# EAGLE design M850x (EAGLE 4.11)
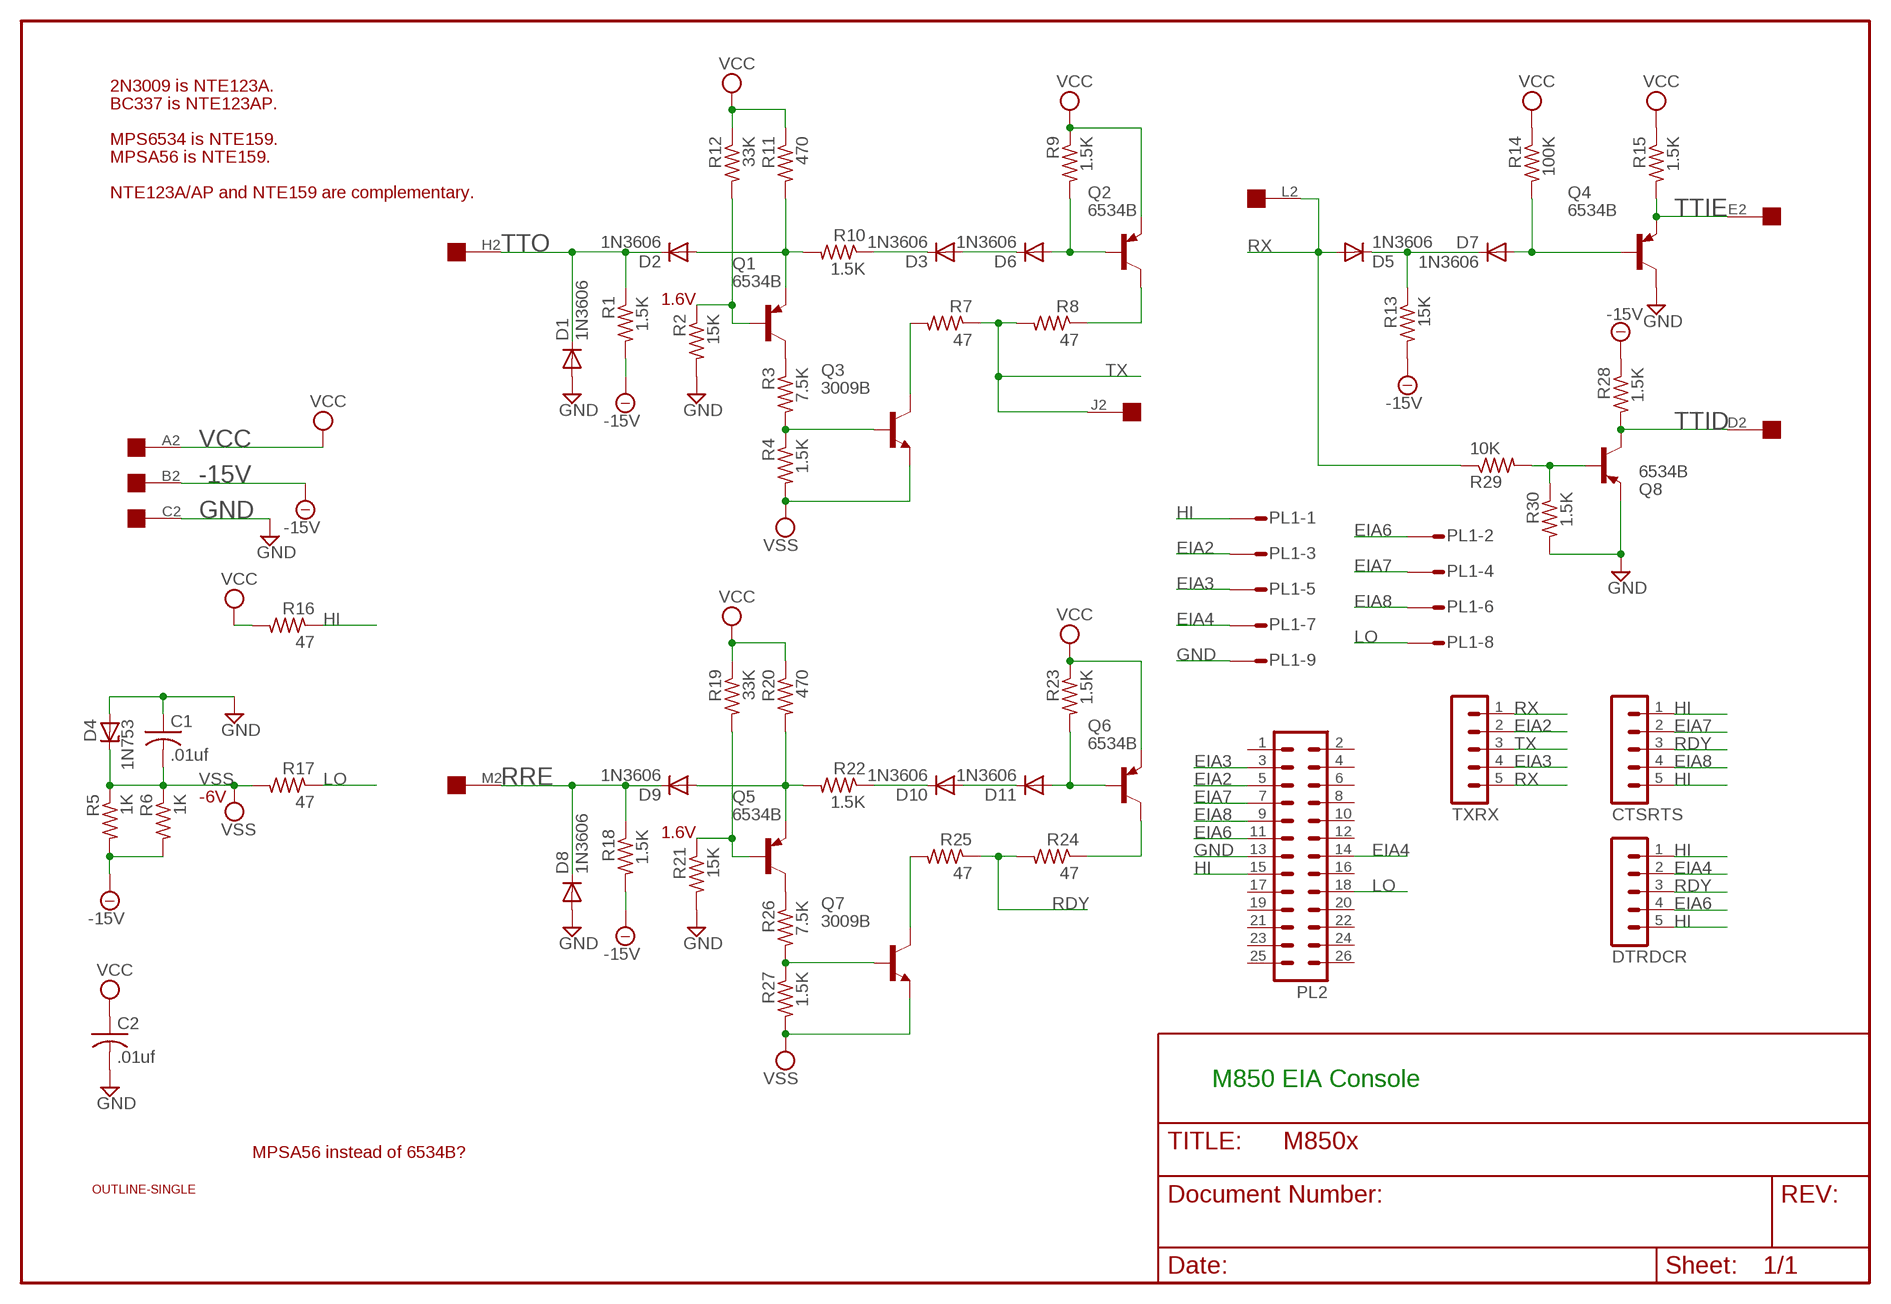
[diagram p0: schematic, sheet 1]

## Parts
C1  .01uf  C-US050-025X075  [C050-025X075]
C2  .01uf  C-US050-025X075  [C050-025X075]
CTSRTS  MA05-1  [MA05-1]
D1  1N3606  1N4148  [DO35-10]
D2  1N3606  1N4148  [DO35-10]
D3  1N3606  1N4148  [DO35-10]
D4  1N753  ZENER-DIODEDO35Z10  [DO35Z10]
D5  1N3606  1N4148  [DO35-10]
D6  1N3606  1N4148  [DO35-10]
D7  1N3606  1N4148  [DO35-10]
D8  1N3606  1N4148  [DO35-10]
D9  1N3606  1N4148  [DO35-10]
D10  1N3606  1N4148  [DO35-10]
D11  1N3606  1N4148  [DO35-10]
DTRDCR  MA05-1  [MA05-1]
EDGE  EDGE-1  [EDGE-CON1]
PL1  10HS  [10H]
PL2  26H  [26H]
Q1  6534B  -PNP-TO92/  [TO92/]
Q2  6534B  -PNP-TO92/  [TO92/]
Q3  3009B  -NPN-TO18-  [TO18-]
Q4  6534B  -PNP-TO92/  [TO92/]
Q5  6534B  -PNP-TO92/  [TO92/]
Q6  6534B  -PNP-TO92/  [TO92/]
Q7  3009B  -NPN-TO18-  [TO18-]
Q8  6534B  -PNP-TO92/  [TO92/]
R1  1.5K  R-US_0207/10  [0207/10]
R2  15K  R-US_0207/10  [0207/10]
R3  7.5K  R-US_0207/10  [0207/10]
R4  1.5K  R-US_0207/10  [0207/10]
R5  1K  R-US_0207/10  [0207/10]
R6  1K  R-US_0207/10  [0207/10]
R7  47  R-US_0207/10  [0207/10]
R8  47  R-US_0207/10  [0207/10]
R9  1.5K  R-US_0207/10  [0207/10]
R10  1.5K  R-US_0207/10  [0207/10]
R11  470  R-US_0207/10  [0207/10]
R12  33K  R-US_0207/10  [0207/10]
R13  15K  R-US_0207/10  [0207/10]
R14  100K  R-US_0207/10  [0207/10]
R15  1.5K  R-US_0207/10  [0207/10]
R16  47  R-US_0207/10  [0207/10]
R17  47  R-US_0207/10  [0207/10]
R18  1.5K  R-US_0207/10  [0207/10]
R19  33K  R-US_0207/10  [0207/10]
R20  470  R-US_0207/10  [0207/10]
R21  15K  R-US_0207/10  [0207/10]
R22  1.5K  R-US_0207/10  [0207/10]
R23  1.5K  R-US_0207/10  [0207/10]
R24  47  R-US_0207/10  [0207/10]
R25  47  R-US_0207/10  [0207/10]
R26  7.5K  R-US_0207/10  [0207/10]
R27  1.5K  R-US_0207/10  [0207/10]
R28  1.5K  R-US_0207/10  [0207/10]
R29  10K  R-US_0207/10  [0207/10]
R30  1.5K  R-US_0207/10  [0207/10]
TXRX  MA05-1  [MA05-1]
U$1  OUTLINE-SINGLE  [SINGLE]

## Nets
-15V: EDGE.B2 R1.2 R5.2 R6.2 R13.2 R18.2 R28.1
EIA2: PL1.3 PL2.5 TXRX.2
EIA3: PL1.5 PL2.3 TXRX.4
EIA4: DTRDCR.2 PL1.7 PL2.14
EIA6: DTRDCR.4 PL1.2 PL2.11
EIA7: CTSRTS.2 PL1.4 PL2.7
EIA8: CTSRTS.4 PL1.6 PL2.9
GND: C1.1 C2.2 D1.A D4.A D8.A EDGE.C2 PL1.9 PL2.13 Q4.3(C) Q8.1(E) R2.2 R21.2 R30.2
HI: CTSRTS.1 CTSRTS.5 DTRDCR.1 DTRDCR.5 PL1.1 PL2.15 R16.1
LO: PL1.8 PL2.18 R17.1
N$1: Q2.3(C) R8.1
N$2: D7.A Q4.2(B) R14.2
N$3: D9.A Q5.1(E) R20.2 R22.2
N$4: Q1.3(C) R3.1
N$5: Q5.2(B) R19.2 R21.1
N$6: D10.A D11.C
N$8: Q3.3(C) R7.2
N$9: D5.C D7.C R13.1
N$10: D2.A Q1.1(E) R10.2 R11.2
N$11: D6.A Q2.2(B) R9.2
N$12: Q1.2(B) R2.1 R12.2
N$13: D3.A D6.C
N$14: D3.C R10.1
N$15: Q3.2(B) R3.2 R4.1
N$16: Q8.2(B) R29.2 R30.1
N$17: D10.C R22.1
N$18: D11.A Q6.2(B) R23.2
N$19: Q6.3(C) R24.1
N$20: Q7.3(C) R25.2
N$21: Q5.3(C) R26.1
N$22: Q7.2(B) R26.2 R27.1
RDY: CTSRTS.3 DTRDCR.3 R24.2 R25.1
RRE: D8.C D9.C EDGE.M2 R18.1
RX: D5.A EDGE.L2 R29.1 TXRX.1 TXRX.5
TTID: EDGE.D2 Q8.3(C) R28.2
TTIE: EDGE.E2 Q4.1(E) R15.2
TTO: D1.C D2.C EDGE.H2 R1.1
TX: EDGE.J2 R7.1 R8.2 TXRX.3
VCC: C2.1 EDGE.A2 Q2.1(E) Q6.1(E) R9.1 R11.1 R12.1 R14.1 R15.1 R16.2 R19.1 R20.1 R23.1
VSS: C1.2 D4.C Q3.1(E) Q7.1(E) R4.2 R5.1 R6.1 R17.2 R27.2
Unconnected: EDGE.F2 EDGE.K2 EDGE.N2 EDGE.P2 EDGE.R2 EDGE.S2 EDGE.T2 EDGE.U2 EDGE.V2 PL1.10 PL2.1 PL2.2 PL2.4 PL2.6 PL2.8 PL2.10 PL2.12 PL2.16 PL2.17 PL2.19 PL2.20 PL2.21 PL2.22 PL2.23 PL2.24 PL2.25 PL2.26

## Notes on the sheet
- 2N3009 is NTE123A.
- BC337 is NTE123AP.
- MPS6534 is NTE159.
- MPSA56 is NTE159.
- NTE123A/AP and NTE159 are complementary.
- 1.6V
- -6V
- 1.6V
- M850 EIA Console
- MPSA56 instead of 6534B?

## Library data of the parts
C1 C2 = rcl:C-US: CAPACITOR, American symbol
CTSRTS DTRDCR TXRX = con-lstb:MA05-1: PIN HEADER
D1-D3 D5-D11 = diode:1N4148: DIODE high speed (Philips)
D4 = diode:ZENER-DIODE: Z-Diode
EDGE = dec-con:EDGE-1: Single-Sided DEC Edge Connector -- (side 2)
PL1 = con-harting-h:10HS: CONNECTOR
PL2 = con-harting-h:26H: CONNECTOR
Q1 Q2 Q4-Q6 Q8 = transistor:*-PNP-: PNP Transistror
Q3 Q7 = transistor:*-NPN-: NPN Transistror
R1-R30 = rcl:R-US_: RESISTOR, American symbol
U$1 = dec-con:OUTLINE-*: Board outlines for DEC boards.

## Board
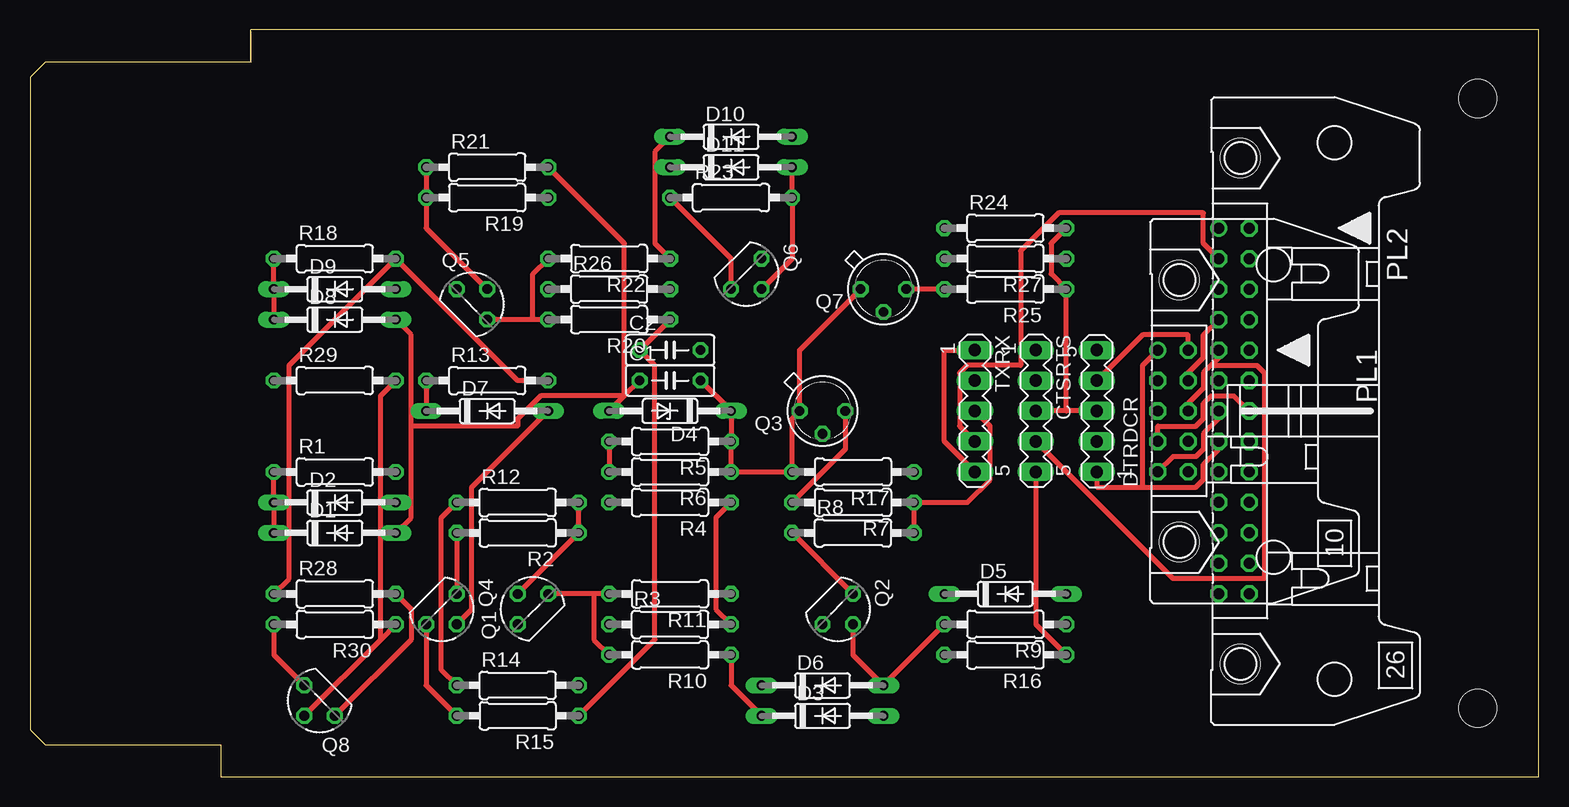
[diagram p1: board, top side]
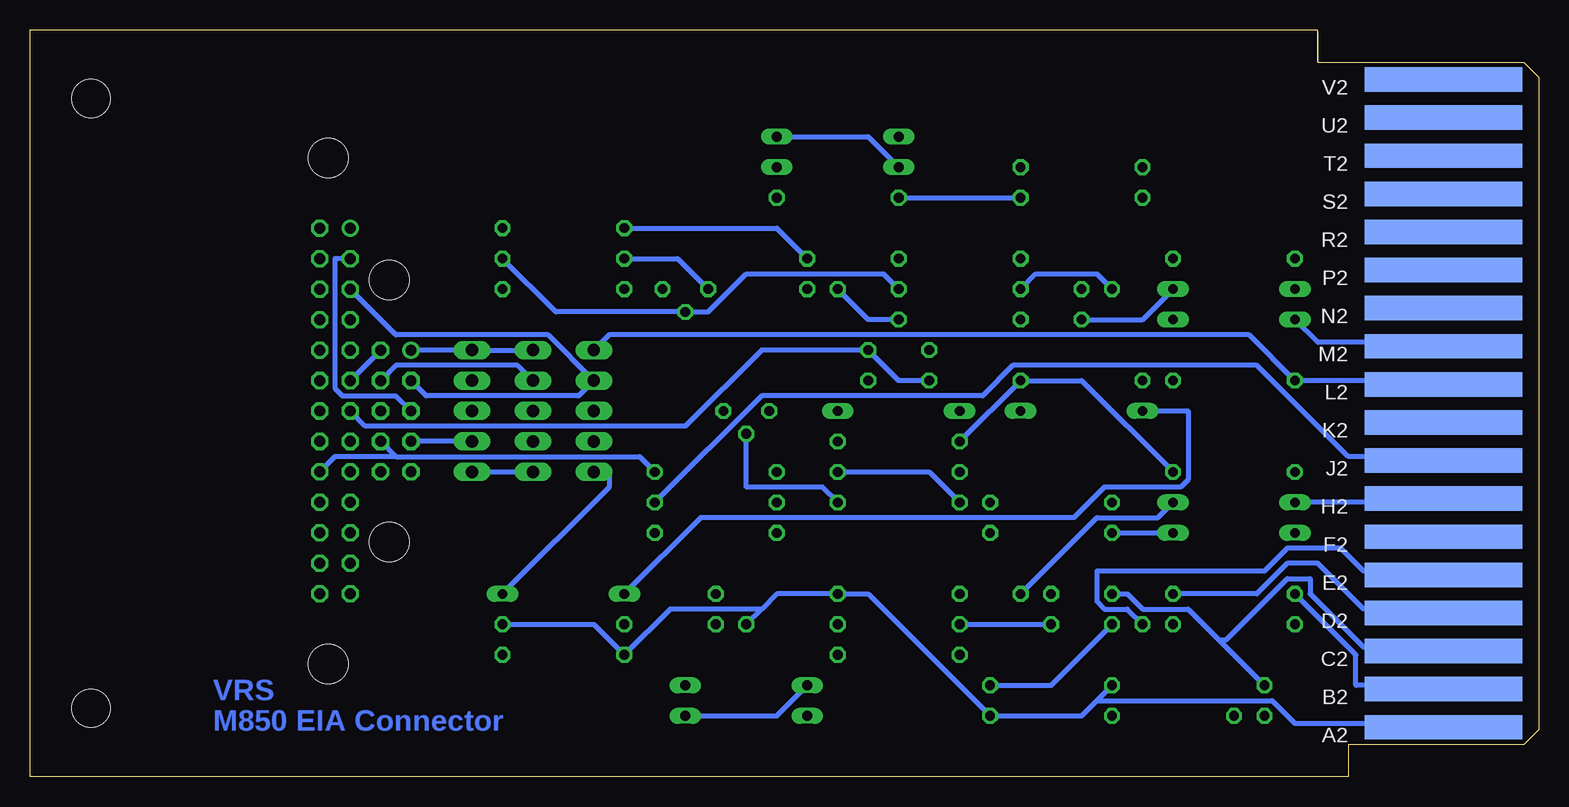
[diagram p2: board, bottom side, seen from below]

Size 125.73 x 62.23 mm. Coordinates in mm from the lower left corner, seen from the top.
Copper layers (1+16): Top 0.035mm / dielectric 1.5mm / Bottom 0.035mm
Design rules "16mils": minimum track width 16mil, minimum drill 32mil, track to track 15mil, track to pad 10mil, pad to pad 10mil, via to via 10mil, smd to smd 10mil, copper to edge 13mil, drill to drill 10mil, minimum pad ring 10mil, minimum via ring 8mil, stop-mask expansion 0mil, vias tented up to drill 0mil, thermal gap 10mil

### Footprints (pad centres in the part's own frame; a part is rotated, then mirrored left to right if it is on the bottom)
C050-025X075 = drill 0.813 octagon: 1 -2.54,0; 2 2.54,0
MA05-1 = drill 1.016 long: 1 -5.08,0; 2 -2.54,0; 3 0,0; 4 2.54,0; 5 5.08,0
DO35-10 = drill 0.813 long: A 5.08,0; C -5.08,0
DO35Z10 = drill 0.813 long: A 5.08,0; C -5.08,0
EDGE-CON1 = smd 13.106 x 2.032 bottom: A2 7.938,4.128; B2 7.938,7.303; C2 7.938,10.477; D2 7.938,13.652; E2 7.938,16.828; F2 7.938,20.003; H2 7.938,23.177; J2 7.938,26.352; K2 7.938,29.527; L2 7.938,32.703; M2 7.938,35.877; N2 7.938,39.053; P2 7.938,42.227; R2 7.938,45.403; S2 7.938,48.578; T2 7.938,51.752; U2 7.938,54.928; V2 7.938,58.102
10H = drill 0.914: 1 -5.08,-1.27 | drill 0.914 octagon: 2 -5.08,1.27; 3 -2.54,-1.27; 4 -2.54,1.27; 5 0,-1.27; 6 0,1.27; 7 2.54,-1.27; 8 2.54,1.27; 9 5.08,-1.27; 10 5.08,1.27 | hole 3.302: -10.922,0.533; 10.922,0.533
26H = drill 0.914: 1 -15.24,-1.27 | drill 0.914 octagon: 2 -15.24,1.27; 3 -12.7,-1.27; 4 -12.7,1.27; 5 -10.16,-1.27; 6 -10.16,1.27; 7 -7.62,-1.27; 8 -7.62,1.27; 9 -5.08,-1.27; 10 -5.08,1.27; 11 -2.54,-1.27; 12 -2.54,1.27; 13 0,-1.27; 14 0,1.27; 15 2.54,-1.27; 16 2.54,1.27; 17 5.08,-1.27; 18 5.08,1.27; 19 7.62,-1.27; 20 7.62,1.27; 21 10.16,-1.27; 22 10.16,1.27; 23 12.7,-1.27; 24 12.7,1.27; 25 15.24,-1.27; 26 15.24,1.27 | hole 3.302: -21.082,0.533; 21.082,0.533
TO92/ = drill 0.813 octagon: 1 1.27,-1.27; 2 1.27,1.27; 3 -1.27,1.27
TO18- = drill 0.813 octagon: 1 1.905,0; 2 0,1.905; 3 -1.905,0
0207/10 = drill 0.813 octagon: 1 -5.08,0; 2 5.08,0
SINGLE = hole 3.175: 120.65,56.515; 120.65,5.715

### Placement (x,y rotation side)
C1  53.34,33.02 0 top
C2  53.34,35.56 0 top
CTSRTS  83.82,30.48 270 top
D1  25.4,20.32 0 top
D2  25.4,22.86 0 top
D3  66.04,5.08 0 top
D4  53.34,30.48 180 top
D5  81.28,15.24 0 top
D6  66.04,7.62 0 top
D7  38.1,30.48 0 top
D8  25.4,38.1 0 top
D9  25.4,40.64 0 top
D10  58.42,53.34 0 top
D11  58.42,50.8 0 top
DTRDCR  88.9,30.48 90 top
EDGE  0,0 0 top
PL1  95.25,30.48 270 top
PL2  100.33,30.48 270 top
Q1  41.91,13.97 90 top
Q2  67.31,13.97 270 top
Q3  66.04,30.48 180 top
Q4  34.29,13.97 270 top
Q5  36.83,39.37 0 top
Q6  59.69,41.91 270 top
Q7  71.12,40.64 180 top
Q8  24.13,6.35 180 top
R1  25.4,25.4 0 top
R2  40.64,20.32 180 top
R3  53.34,12.7 0 top
R4  53.34,22.86 180 top
R5  53.34,27.94 180 top
R6  53.34,25.4 180 top
R7  68.58,22.86 180 top
R8  68.58,20.32 0 top
R9  81.28,12.7 180 top
R10  53.34,10.16 180 top
R11  53.34,15.24 180 top
R12  40.64,22.86 0 top
R13  38.1,33.02 0 top
R14  40.64,7.62 0 top
R15  40.64,5.08 180 top
R16  81.28,10.16 180 top
R17  68.58,25.4 180 top
R18  25.4,43.18 0 top
R19  38.1,48.26 180 top
R20  48.26,38.1 180 top
R21  38.1,50.8 0 top
R22  48.26,43.18 180 top
R23  58.42,48.26 0 top
R24  81.28,45.72 0 top
R25  81.28,40.64 180 top
R26  48.26,40.64 0 top
R27  81.28,43.18 180 top
R28  25.4,15.24 0 top
R29  25.4,33.02 0 top
R30  25.4,12.7 180 top
TXRX  78.74,30.48 270 top
U$1  0,0 0 top

### Tracks (layer width: path | path; a pad name or v marks a point on that pad's centre or on a via)
-15V
  Top 0.406: R5.2 R6.2 | R13.2 40.64,33.02 R18.2 21.59,34.29 21.59,16.51 R28.1
  Bottom 0.406: R1.2 38.1,33.02 R13.2 R5.2 | R28.1 15.24,10.16 15.24,7.62 8.26,7.62 EDGE.B2
EIA2
  Bottom 0.406: PL1.3 92.71,31.75 80.01,31.75 TXRX.2 82.55,36.83 95.25,36.83 PL2.5
EIA3
  Top 0.406: TXRX.4 77.47,29.21 77.47,33.66 78.11,34.29 82.55,34.29 82.55,43.81 85.73,46.99 97.79,46.99 97.79,44.45 PL2.3
  Bottom 0.406: PL1.5 95.25,31.75 99.7,31.75 100.33,32.38 100.33,43.18 PL2.3
EIA4
  Top 0.406: PL2.14 100.33,31.75 98.43,31.75 97.79,31.11 97.79,29.84 97.16,29.21 93.98,29.21 PL1.7
  Bottom 0.406: DTRDCR.2 PL1.7
EIA6
  Top 0.406: DTRDCR.4 92.71,36.83 96.52,36.83 PL1.2
  Bottom 0.406: PL1.2 PL2.11
EIA7
  Top 0.406: PL2.7 97.79,36.83 97.79,34.92 96.52,33.66 PL1.4
  Bottom 0.406: PL1.4 95.25,34.29 85.09,34.29 CTSRTS.2
EIA8
  Top 0.406: PL1.6 96.52,31.11 97.79,32.38 97.79,33.66 98.43,34.29 | 98.43,34.29 99.06,34.92 PL2.9 | CTSRTS.4 95.25,16.51 102.87,16.51 102.87,33.66 102.24,34.29 98.43,34.29
GND
  Top 0.406: Q8.1 20.32,10.16 R30.2 | R2.2 Q4.3 | D8.A 31.75,36.83 31.75,29.21 | 31.75,29.21 31.75,21.59 D1.A | PL1.9 95.25,26.67 97.16,26.67 97.79,27.3 97.79,28.57 99.06,29.84 PL2.13 | C1.1 49.53,31.75 | 49.53,31.75 D4.A | R21.2 49.53,44.45 49.53,31.75 | 31.75,29.21 40.64,29.21 40.64,29.84 42.55,31.75 49.53,31.75
  Bottom 0.406: R2.2 D1.A | 26.67,11.43 29.21,13.97 33.02,13.97 34.29,15.24 Q4.3 | 26.67,11.43 Q8.1 | 26.67,11.43 26.04,11.43 20.96,16.51 19.05,16.51 19.05,15.24 14.61,10.79 8.26,10.79 EDGE.C2 | C1.1 53.34,33.02 C2.2 64.77,35.56 71.12,29.21 97.79,29.21 PL2.13
HI
  Top 0.406: R16.1 83.82,12.7 CTSRTS.5 | PL2.15 99.06,27.3 97.79,26.04 97.79,24.77 97.16,24.13 92.71,24.13 | 92.71,24.13 88.9,24.13 DTRDCR.1 | PL1.1 92.71,34.29 92.71,24.13
  Bottom 0.406: PL1.1 DTRDCR.5 CTSRTS.1 | DTRDCR.1 CTSRTS.5
LO
  Bottom 0.406: R17.1 74.93,26.67 95.25,26.67 | PL1.8 95.25,26.67 | PL2.18 100.33,26.67 95.25,26.67
N$1
  Top 0.406: Q2.3 R8.1
N$2
  Top 0.406: D7.A 36.83,24.13 36.83,13.97 Q4.2
  Bottom 0.406: Q4.2 40.64,7.62 R14.2
N$3
  Top 0.406: R20.2 41.91,38.1 | 41.91,38.1 Q5.1 | R22.2 41.91,41.91 41.91,38.1
  Bottom 0.406: D9.A 33.02,38.1 Q5.1
N$4
  Bottom 0.406: R3.1 Q1.3
N$5
  Top 0.406: R21.1 R19.2 33.02,45.72 Q5.2
N$6
  Bottom 0.406: D11.C 55.88,53.34 D10.A
N$8
  Top 0.406: R7.2 67.95,27.3 Q3.3
N$9
  Top 0.406: R13.1 D7.C
  Bottom 0.406: D5.C 69.85,21.59 38.74,21.59 36.2,24.13 29.85,24.13 29.21,24.77 29.21,30.48 D7.C
N$10
  Top 0.406: R11.2 46.99,15.24 | 46.99,15.24 Q1.1 | R10.2 46.99,11.43 46.99,15.24
  Bottom 0.406: D2.A 31.75,21.59 36.83,21.59 Q1.1
N$11
  Top 0.406: Q2.2 68.58,10.16 D6.A R9.2
N$12
  Top 0.406: Q1.2 R2.1 R12.2
N$13
  Bottom 0.406: D6.C 63.5,5.08 D3.A
N$14
  Top 0.406: D3.C 58.42,7.62 R10.1
N$15
  Top 0.406: R3.2 57.15,13.97 57.15,21.59 R4.1
  Bottom 0.406: Q3.2 66.04,24.13 59.69,24.13 R4.1
N$16
  Top 0.406: R30.1 29.21,11.43 | 29.21,11.43 Q8.2 | R29.2 29.21,31.75 29.21,11.43
N$17
  Top 0.406: R22.1 52.07,44.45 52.07,52.07 D10.C
N$18
  Top 0.406: Q6.2 63.5,43.18 R23.2 D11.A
N$19
  Bottom 0.406: Q6.3 63.5,45.72 R24.1
N$20
  Top 0.406: R25.2 Q7.3
N$21
  Bottom 0.406: Q5.3 36.83,41.91 41.91,41.91 R26.1
N$22
  Bottom 0.406: R26.2 54.61,41.91 66.04,41.91 69.22,38.73 Q7.2 81.92,38.73 R27.1
RDY
  Top 0.406: R24.2 85.09,44.45 85.09,41.91 R25.1 86.36,30.48 | DTRDCR.3 86.36,30.48 | 86.36,30.48 CTSRTS.3
RRE
  Top 0.406: D8.C D9.C R18.1
  Bottom 0.406: D8.C 18.42,36.2 8.26,36.2 EDGE.M2
RX
  Top 0.406: TXRX.1 76.2,35.56 76.2,27.94 TXRX.5
  Bottom 0.406: D5.A 77.47,24.13 77.47,25.4 TXRX.5 | EDGE.L2 8.26,33.02 R29.1 24.13,36.83 77.47,36.83 TXRX.1
TTID
  Top 0.406: Q8.3 31.75,11.43 31.75,13.97 R28.2
  Bottom 0.406: R28.2 23.5,15.24 20.96,17.78 18.42,17.78 14.61,13.97 8.26,13.97 EDGE.D2
TTIE
  Top 0.406: R15.2 33.02,7.62 Q4.1
  Bottom 0.406: Q4.1 34.29,13.97 36.2,13.97 36.83,14.61 36.83,17.14 22.86,17.14 20.96,19.05 16.51,19.05 14.61,17.14 8.26,17.14 EDGE.E2
TTO
  Top 0.406: D1.C D2.C R1.1
  Bottom 0.406: D2.C 8.26,22.86 EDGE.H2
TX
  Top 0.406: R8.2 R7.1 78.11,22.86 80.01,24.77 80.01,29.21 TXRX.3
  Bottom 0.406: R7.1 64.77,31.75 46.36,31.75 43.82,34.29 23.5,34.29 15.88,26.67 8.26,26.67 EDGE.J2
VCC
  Top 0.406: R20.1 C2.1 52.07,34.29 52.07,11.43 R15.1 | R23.1 58.42,43.18 Q6.1 | R12.1 34.29,21.59 34.29,8.89 R14.1
  Bottom 0.406: R23.1 R19.1 | Q6.1 55.88,38.1 R20.1 | R9.1 78.74,12.7 R16.2 72.39,13.97 64.77,13.97 | 36.83,6.35 38.1,5.08 R15.1 55.88,15.24 R11.1 63.5,15.24 64.77,13.97 | 36.83,6.35 R14.1 | 64.77,13.97 Q2.1 | 36.83,6.35 22.23,6.35 20.32,4.45 8.26,4.45 EDGE.A2
VSS
  Top 0.406: C1.2 D4.C R5.1 R6.1 R17.2 63.5,29.84 Q3.1 64.14,35.56 Q7.1
  Bottom 0.406: Q7.1 71.76,43.18 R27.2 | R4.2 50.8,25.4 R6.1

### Text on the board
Bottom: VRS | M850 EIA Connector